# Altium schematic sheet VideoControl.SchDoc
size A4
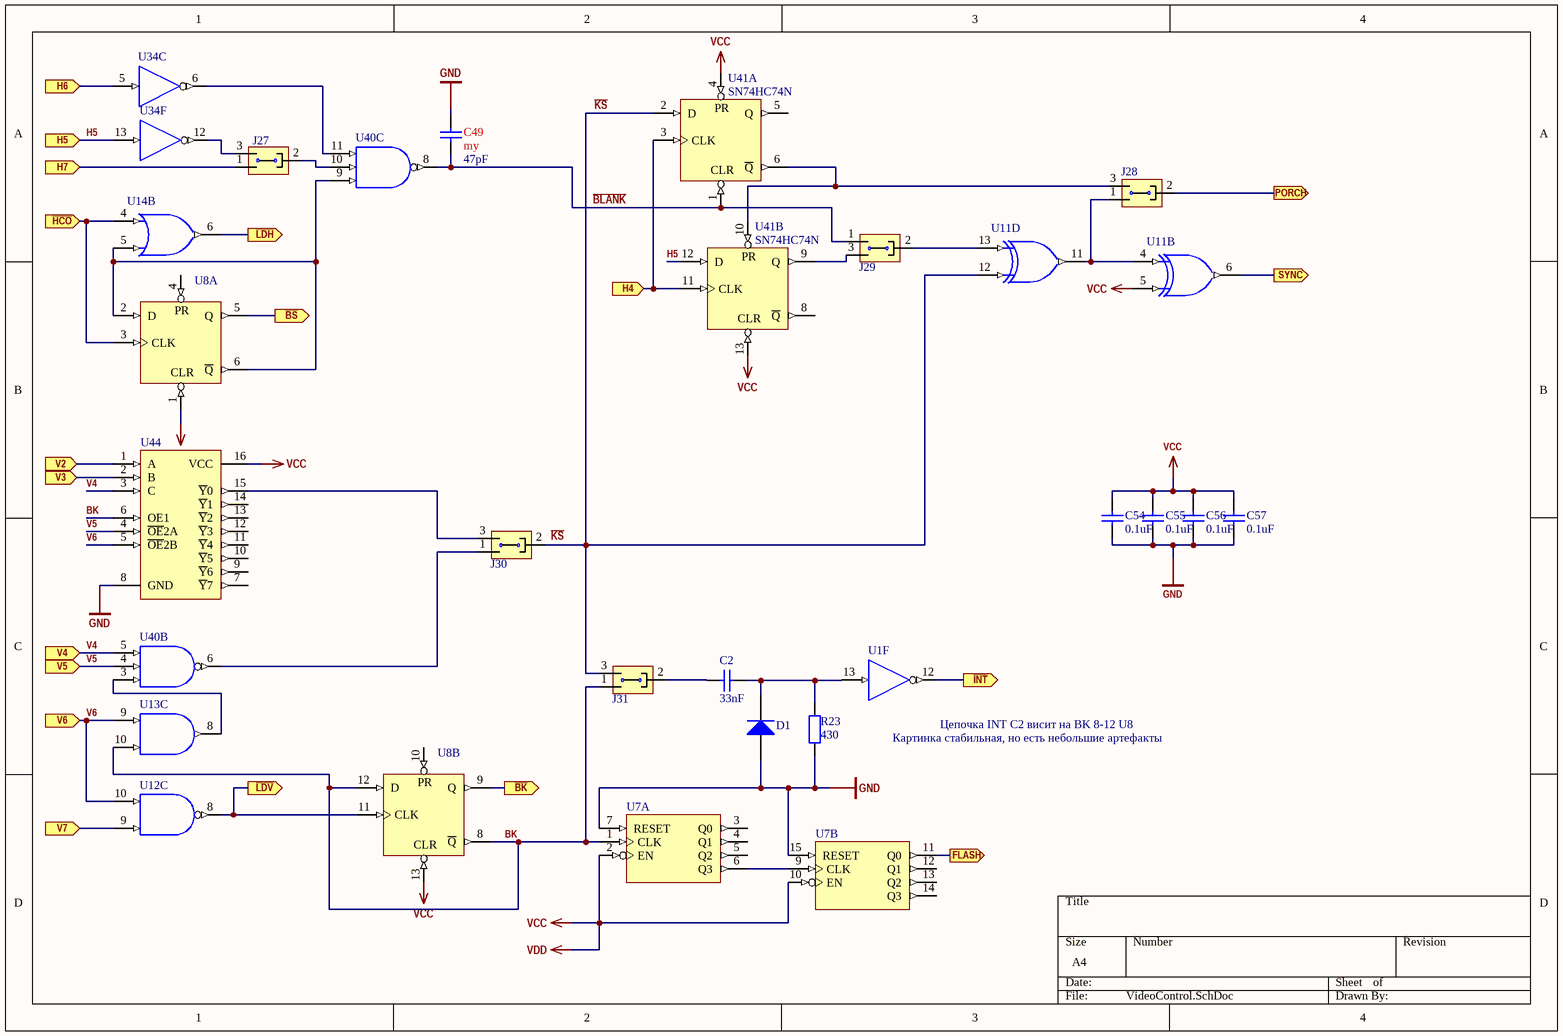
[diagram p0: VideoControl.SchDoc]

## Parts
C2  value 33nF  [RAD-0.3]  (hidden comment: Cap)
C49  my  value 47pF  [RAD-0.3]
C54  value 0.1uF  [RAD-0.3]  (hidden comment: Cap)
C55  value 0.1uF  [RAD-0.3]  (hidden comment: Cap)
C56  value 0.1uF  [RAD-0.3]  (hidden comment: Cap)
C57  value 0.1uF  [RAD-0.3]  (hidden comment: Cap)
D1  Diode 1N4148  [DO-35]  (value not drawn)
J27  Jump3  [MHDR1X3]  (value not drawn)
J28  Jump3  [MHDR1X3]  (value not drawn)
J29  Jump3  [MHDR1X3]  (value not drawn)
J30  Jump3  [MHDR1X3]  (value not drawn)
J31  Jump3  [MHDR1X3]  (value not drawn)
R23  value 430  [AXIAL-0.4]
U1  (no value)  [N014]  (part F of 6)
U7  (no value)  [648-08]  (parts A,B of 2)
U8  (no value)  [N014]  (parts A,B of 2)
U11  (no value)  [N014]  (parts B,D of 4)
U12  (no value)  [N014]  (part C of 4)
U13  (no value)  [N014]  (part C of 4)
U14  (no value)  [N014]  (part B of 4)
U34  (no value)  [N014]  (parts C,F of 6)
U40  (no value)  [N014]  (parts B,C of 3)
U41  SN74HC74N  [N014]  (parts A,B of 2)
U44  (no value)  [N016]

## Ports
FLASH (out), H4 (in), H5 (in), H6 (in), H7 (in), PORCH (out), SYNC (out), V2 (in), V3 (in), V4 (in), V5 (in), V6 (in), V7 (in), ~{BK} (out), ~{BS} (out), ~{HCO} (in), ~{INT} (out), ~{LDH} (out), ~{LDV} (out)

## Nets
GND: C49.1 C54.1 C55.1 C56.1 C57.1 D1.1(A) R23.1 U1.7(GND) U7.7(RESET) U7.8(GND) U7.15(RESET) U8.7(GND) U11.7(GND) U12.7(GND) U13.7(GND) U14.7(GND) U34.7(GND) U40.7(GND) U41.7(GND) U44.8(GND)
VCC: C54.2 C55.2 C56.2 C57.2 U1.14(VCC) U7.2(EN) U7.10(EN) U7.16(VDD) U8.1(CLR) U8.13(CLR) U8.14(VCC) U11.5(B) U11.14(VCC) U12.14(VCC) U13.14(VCC) U14.14(VCC) U34.14(VCC) U40.14(VCC) U41.4(PR) U41.13(CLR) U41.14(VCC) U44.16(VCC)  [also labelled VDD]
~{BK}: U8.9(Q) ; port ~{BK}
~{BLANK}: C49.2 J29.1 U40.8(Y) U41.1(CLR)
~{BS}: U8.5(Q) ; port ~{BS}
BK: J31.1 U7.1(CLK) U8.8(~{Q}) U8.12(D) U13.10(B) U44.6(OE1)
FLASH: U7.11(Q0) ; port FLASH
H4: U41.3(CLK) U41.11(CLK) ; port H4
H5: U34.13(A) U41.12(D) ; port H5
H6: U34.5(A) ; port H6
H7: J27.1 ; port H7
~{HCO}: U8.3(CLK) U14.4(A) ; port ~{HCO}
~{INT}: U1.12(Y) ; port ~{INT}
~{KS}: J30.2 J31.3 U11.12(A) U41.2(D)
~{LDH}: U14.6(Y) ; port ~{LDH}
~{LDV}: U8.11(CLK) U12.8(Y) ; port ~{LDV}
PORCH: J28.2 ; port PORCH
SYNC: U11.6(Y) ; port SYNC
V2: U44.1(A) ; port V2
V3: U44.2(B) ; port V3
V4: U40.5(C) U44.3(C) ; port V4
V5: U40.4(B) U44.4(~{OE}2A) ; port V5
V6: U12.10(B) U13.9(A) U44.5(~{OE}2B) ; port V6
V7: U12.9(A) ; port V7
NetC2_1: C2.1 J31.2
NetC2_2: C2.2 D1.2(K) R23.2 U1.13(A)
NetJ27_2: J27.2 U40.10(B)
NetJ27_3: J27.3 U34.12(Y)
NetJ28_1: J28.1 U11.4(A) U11.11(Y)
NetJ28_3: J28.3 U41.6(~{Q}) U41.10(PR)
NetJ29_2: J29.2 U11.13(B)
NetJ29_3: J29.3 U41.9(Q)
NetJ30_1: J30.1 U40.6(Y)
NetJ30_3: J30.3 U44.15(~{Y}0)
NetU7_6: U7.6(Q3) U7.9(CLK)
NetU8_2: U8.2(D) U8.6(~{Q}) U14.5(B) U40.9(A)
NetU13_8: U13.8(Y) U40.3(A)
NetU34_6: U34.6(Y) U40.11(C)

Not connected (* = marked no-connect by the designer): U7 3(Q0) 4(Q1) 5(Q2) 12(Q1) 13(Q2) 14(Q3); U8 4(PR) 10(PR); U41 5(Q) 8(~{Q}); U44 7(~{Y}7) 9(~{Y}6) 10(~{Y}5) 11(~{Y}4) 12(~{Y}3) 13(~{Y}2) 14(~{Y}1)

## Notes on the sheet
- Картинка стабильная, но есть небольшие артефакты
- (near U1) Цепочка INT C2 висит на BK 8-12 U8
- Labels drawn without touching a wire or pin: ~{KS}

## Library data of the parts
C2 C49 C54-C57 = Cap: Capacitor; Published: 8-Jun-2000; LatestRevisionDate: 17-Jul-2002; LatestRevisionNote: Re-released for DXP Platform.; PackageReference: RAD-0.3; Publisher: Altium Limited; PackageDescription: Radial Cap, Thru-Hole; 2 Leads; 0.3 in Pin Spacing
D1 = Diode 1N4148: High Conductance Fast Diode; Published: 8-Jun-2000; LatestRevisionDate: 17-Jul-2002; LatestRevisionNote: Re-released for DXP Platform.; DatasheetVersion: 1997; PackageReference: DO-35; Publisher: Altium Limited; PackageDescription: Diode, Axial; Body 3.8 x 1.9 mm (LxDia. max), Lead Dia. 0.53 mm (max); Code_JEDEC: DO-204-AH; ComponentLink1Description: Manufacturer Link; ComponentLink1URL: http://www.fairchildsemi.com/; ComponentLink2Description: Datasheet; ComponentLink2URL: http://www.fairchildsemi.com/ds/1N%2F1N4148.pdf
R23 = Res2: Resistor; Published: 8-Jun-2000; LatestRevisionDate: 17-Jul-2002; LatestRevisionNote: Re-released for DXP Platform.; PackageReference: AXIAL-0.4; Publisher: Altium Limited; PackageDescription: Axial Device, Thru-Hole; 2 Leads; 0.4 in Pin Spacing
U1 U34 = SN74HC04N: Hex Inverter; Published: 8-Jun-2000; LatestRevisionDate: 04-Mar-2005; LatestRevisionNote: Stylized 3D Model Added.; DatasheetVersion: May-1997; PackageVersion: Oct-1995; PackageReference: N014; Publisher: Altium Limited; PackageDescription: DIP; 14 Leads; Row Spacing 7.62 mm; Pitch 2.54 mm; ComponentLink1Description: Manufacturer Link; ComponentLink1URL: http://www.ti.com/; ComponentLink2Description: Datasheet; ComponentLink2URL: http://www-s.ti.com/sc/ds/sn74hc04.pdf
U7 = MC14520BCP: Dual Binary Up Counter; Published: 15-Apr-2002; DatasheetVersion: 1995; PackageVersion: Apr-2000; PackageReference: 648-08; Publisher: Altium Limited; PackageDescription: DIP; 16 Leads; Row Spacing 7.62 mm; Pitch 2.54 mm; Code_JEDEC: MS-001-BB; ComponentLink1Description: Manufacturer Link; ComponentLink1URL: http://www.onsemi.com/; ComponentLink2Description: Datasheet; ComponentLink2URL: http://www.onsemi.com/pub/Collateral/MC14518B-D.PDF
U8 U41 = SN74HC74N: Dual D-Type Positive-Edge-Triggered Flip-Flop with Clear and Preset; Published: 8-Jun-2000; LatestRevisionDate: 04-Mar-2005; LatestRevisionNote: Stylized 3D Model Added.; DatasheetVersion: May-1997; PackageVersion: Oct-1995; PackageReference: N014; Publisher: Altium Limited; PackageDescription: DIP; 14 Leads; Row Spacing 7.62 mm; Pitch 2.54 mm; ComponentLink1Description: Manufacturer Link; ComponentLink1URL: http://www.ti.com/; ComponentLink2Description: Datasheet; ComponentLink2URL: http://www-s.ti.com/sc/ds/sn74hc74.pdf
U11 = SN74HC86N: Quadruple 2-Input Exclusive-OR Gate; Published: 8-Jun-2000; LatestRevisionDate: 04-Mar-2005; LatestRevisionNote: Stylized 3D Model Added.; DatasheetVersion: Aug-1999; PackageVersion: Oct-1995; PackageReference: N014; Publisher: Altium Limited; PackageDescription: DIP; 14 Leads; Row Spacing 7.62 mm; Pitch 2.54 mm; ComponentLink1Description: Manufacturer Link; ComponentLink1URL: http://www.ti.com/; ComponentLink2Description: Datasheet; ComponentLink2URL: http://www-s.ti.com/sc/ds/SN54HC86.pdf
U12 = SN74HC00N: Quadruple 2-Input Positive-NAND Gate; Published: 8-Jun-2000; LatestRevisionDate: 04-Mar-2005; LatestRevisionNote: Stylized 3D Model Added.; DatasheetVersion: May-1997; PackageVersion: Oct-1995; PackageReference: N014; Publisher: Altium Limited; PackageDescription: DIP; 14 Leads; Row Spacing 7.62 mm; Pitch 2.54 mm; ComponentLink1Description: Manufacturer Link; ComponentLink1URL: http://www.ti.com/; ComponentLink2Description: Datasheet; ComponentLink2URL: http://www-s.ti.com/sc/ds/sn74hc00.pdf
U13 = SN74HC08N: Quadruple 2-Input Positive-AND Gate; Published: 8-Jun-2000; LatestRevisionDate: 04-Mar-2005; LatestRevisionNote: Stylized 3D Model Added.; DatasheetVersion: May-1997; PackageVersion: Oct-1995; PackageReference: N014; Publisher: Altium Limited; PackageDescription: DIP; 14 Leads; Row Spacing 7.62 mm; Pitch 2.54 mm; ComponentLink1Description: Manufacturer Link; ComponentLink1URL: http://www.ti.com/; ComponentLink2Description: Datasheet; ComponentLink2URL: http://www-s.ti.com/sc/ds/SN74HC08.pdf
U14 = SN74HC32N: Quadruple 2-Input Positive-OR Gate; Published: 8-Jun-2000; LatestRevisionDate: 04-Mar-2005; LatestRevisionNote: Stylized 3D Model Added.; DatasheetVersion: May-1997; PackageVersion: Oct-1995; PackageReference: N014; Publisher: Altium Limited; PackageDescription: DIP; 14 Leads; Row Spacing 7.62 mm; Pitch 2.54 mm; ComponentLink1Description: Manufacturer Link; ComponentLink1URL: http://www.ti.com/; ComponentLink2Description: Datasheet; ComponentLink2URL: http://www-s.ti.com/sc/ds/sn74hc32.pdf
U40 = SN74HC10N: Triple 3-Input Positive-NAND Gate; Published: 8-Jun-2000; LatestRevisionDate: 04-Mar-2005; LatestRevisionNote: Stylized 3D Model Added.; DatasheetVersion: May-1997; PackageVersion: Oct-1995; PackageReference: N014; Publisher: Altium Limited; PackageDescription: DIP; 14 Leads; Row Spacing 7.62 mm; Pitch 2.54 mm; ComponentLink1Description: Manufacturer Link; ComponentLink1URL: http://www.ti.com/; ComponentLink2Description: Datasheet; ComponentLink2URL: http://www-s.ti.com/sc/ds/sn74hc10.pdf
U44 = SN74HC138N: 3-Line to 8-Line Decoder / Demultiplexer; Published: 8-Jun-2000; LatestRevisionDate: 04-Mar-2005; LatestRevisionNote: Stylized 3D Model Added.; DatasheetVersion: May-1997; PackageVersion: Oct-1995; PackageReference: N016; Publisher: Altium Limited; PackageDescription: DIP; 16 Leads; Row Spacing 7.62 mm; Pitch 2.54 mm; ComponentLink1Description: Manufacturer Link; ComponentLink1URL: http://www.ti.com/; ComponentLink2Description: Datasheet; ComponentLink2URL: http://www-s.ti.com/sc/ds/sn74hc138.pdf; Code_JEDEC: MS-001-BB